# Altium project MainBoard_V100.PrjPcb (part 1 of 3)
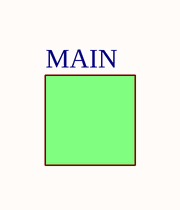
[diagram p0: MainBoard_V100_FRP.SchDoc]
GAuthor: Mihaly Szabo (PHY1HI); GBoardName: MainBoard; GContact: szabomihaly2000@gmail.com; GProjectName: RIID; GVersion: V100
22 sheets, 323 parts. Net scope: flat (ports and power ports of the same name join across sheets).
Board file: MainBoard_V100.PcbDoc
Sheets:
  MainBoard_V100_FRP.SchDoc
    MAIN = MainBoard_V100_MAIN.SchDoc
      PSU = MainBoard_V100_PSU.SchDoc
        PSU_DIG = MainBoard_V100_PSU_DIG.SchDoc
        U_MainBoard_V100_PSU_DET = MainBoard_V100_PSU_DET.SchDoc
        PSU_AFE = MainBoard_V100_PSU_AFE.SchDoc
        U_MainBoard_V100_CHARGER = MainBoard_V100_CHARGER.SchDoc
        PSU_5V = MainBoard_V100_PSU_5V.SchDoc
      CON = MainBoard_V100_CON.SchDoc
      AFE = MainBoard_V100_AFE.SchDoc
        U_MainBoard_V100_BLR = MainBoard_V100_BLR.SchDoc
        U_MainBoard_V100_CSP = MainBoard_V100_CSP.SchDoc
        U_MainBoard_V100_PEAKDET = MainBoard_V100_PEAKDET.SchDoc
      MEM = MainBoard_V100_MEM.SchDoc
      ON_OFF = MainBoard_V100_ON_OFF.SchDoc
      SD = MainBoard_V100_SD.SchDoc
      USB_MUX = MainBoard_V100_USB_MUX.SchDoc
      PER = MainBoard_V100_PER.SchDoc
      MCU = MainBoard_V100_MCU.SchDoc
      BLE = MainBoard_V100_BLE.SchDoc
      DISPLAY = MainBoard_V100_DISP.SchDoc
      TEMP = MainBoard_V100_TEMP.SchDoc

## Sheet MainBoard_V100_FRP.SchDoc
size A4; SheetNumber: 1; SheetTotal: 17

### Sub-sheets
MAIN = MainBoard_V100_MAIN.SchDoc: no entries

### Notes on the sheet
- Board:
- Author:
- Title:
- Project:
- SVN:
- Version:
- Sheet:
- of
- Contact:
- Modified:
- Size:
- A4

## Sheet MainBoard_V100_MAIN.SchDoc
size A4; SheetNumber: 2; SheetTotal: 22; Title_: Main Page
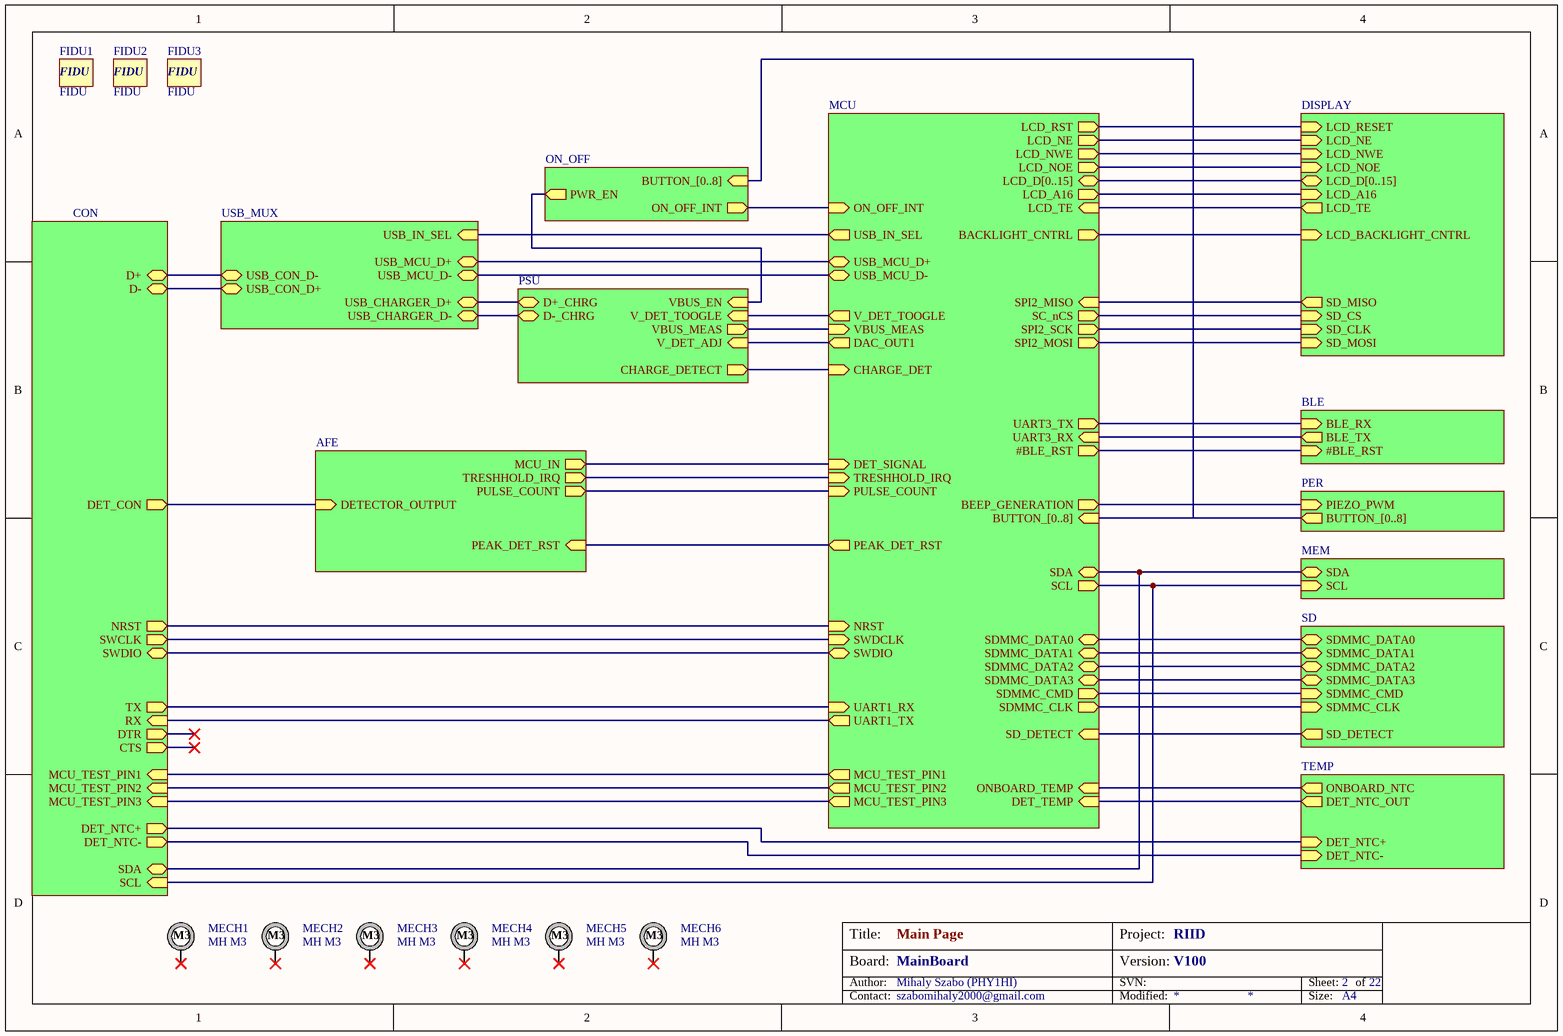
[diagram p1: MainBoard_V100_MAIN.SchDoc]

### Parts
FIDU1  FIDU  [FIDU_4x4]  (no BOM)
FIDU2  FIDU  [FIDU_4x4]  (no BOM)
FIDU3  FIDU  [FIDU_4x4]  (no BOM)
MECH1  MH M3  [PAD_M3 x 7]  (no BOM)
MECH2  MH M3  [PAD_M3 x 7]  (no BOM)
MECH3  MH M3  [PAD_M3 x 7]  (no BOM)
MECH4  MH M3  [PAD_M3 x 7]  (no BOM)
MECH5  MH M3  [PAD_M3 x 7]  (no BOM)
MECH6  MH M3  [PAD_M3 x 7]  (no BOM)

### Sub-sheets
AFE = MainBoard_V100_AFE.SchDoc: PEAK_DET_RST (in), TRESHHOLD_IRQ (out), PULSE_COUNT (out), DETECTOR_OUTPUT (in), MCU_IN (out)
BLE = MainBoard_V100_BLE.SchDoc: BLE_RX (in), BLE_TX (out), #BLE_RST (in)
CON = MainBoard_V100_CON.SchDoc: D+ (bidir), D- (bidir), CTS (out), TX (out), RX (in), DTR (out), NRST (out), SWCLK (out), SWDIO (bidir), DET_CON (out), DET_NTC+ (out), SDA (bidir), SCL (in), DET_NTC- (out), MCU_TEST_PIN1 (in), MCU_TEST_PIN2 (in), MCU_TEST_PIN3 (in)
DISPLAY = MainBoard_V100_DISP.SchDoc: LCD_RESET (in), LCD_NE (in), LCD_NWE (in), LCD_NOE (in), SD_MOSI (in), SD_CLK (in), SD_MISO (out), SD_CS (in), LCD_D[0..15] (bidir), LCD_A16 (in), LCD_TE (out), LCD_BACKLIGHT_CNTRL (in)
MCU = MainBoard_V100_MCU.SchDoc: #BLE_RST (out), BACKLIGHT_CNTRL (out), BEEP_GENERATION (out), DAC_OUT1 (out), DET_SIGNAL (in), LCD_A16 (out), LCD_D[0..15] (bidir), LCD_NE (out), LCD_NOE (out), LCD_NWE (out), LCD_RST (out), LCD_TE (in), NRST (in), ON_OFF_INT (in), PEAK_DET_RST (out), SCL (out), SDA (bidir), SDMMC_CLK (out), SDMMC_CMD (out), SD_DETECT (in), SPI2_MISO (in), SPI2_MOSI (out), SPI2_SCK (out), SWDCLK (in), SWDIO (bidir), TRESHHOLD_IRQ (in), UART1_RX (in), UART1_TX (out), UART3_RX (in), UART3_TX (out), USB_IN_SEL (out), USB_MCU_D+ (bidir), USB_MCU_D- (bidir), SDMMC_DATA3 (bidir), SDMMC_DATA2 (bidir), SDMMC_DATA0 (bidir), SDMMC_DATA1 (bidir), BUTTON_[0..8] (in), VBUS_MEAS (in), V_DET_TOOGLE (out), DET_TEMP (in), ONBOARD_TEMP (in), PULSE_COUNT (in), CHARGE_DET (in), SC_nCS (out), MCU_TEST_PIN1 (out), MCU_TEST_PIN2 (out), MCU_TEST_PIN3 (out)
MEM = MainBoard_V100_MEM.SchDoc: SDA (bidir), SCL (in)
ON_OFF = MainBoard_V100_ON_OFF.SchDoc: ON_OFF_INT (out), PWR_EN (out), BUTTON_[0..8] (in)
PER = MainBoard_V100_PER.SchDoc: PIEZO_PWM (in), BUTTON_[0..8] (out)
PSU = MainBoard_V100_PSU.SchDoc: VBUS_EN (in), VBUS_MEAS (out), D-_CHRG (bidir), D+_CHRG (bidir), V_DET_TOOGLE (in), V_DET_ADJ (in), CHARGE_DETECT (out)
SD = MainBoard_V100_SD.SchDoc: SDMMC_DATA1 (bidir), SDMMC_DATA0 (bidir), SDMMC_DATA3 (bidir), SDMMC_DATA2 (bidir), SD_DETECT (out), SDMMC_CLK (in), SDMMC_CMD (in)
TEMP = MainBoard_V100_TEMP.SchDoc: ONBOARD_NTC (out), DET_NTC- (in), DET_NTC+ (in), DET_NTC_OUT (out)
USB_MUX = MainBoard_V100_USB_MUX.SchDoc: USB_IN_SEL (in), USB_CON_D- (bidir), USB_CON_D+ (bidir), USB_MCU_D- (bidir), USB_MCU_D+ (bidir), USB_CHARGER_D- (bidir), USB_CHARGER_D+ (bidir)

### Nets
(unnamed): sheet PSU/VBUS_EN, sheet ON_OFF/PWR_EN
(unnamed): sheet PSU/VBUS_MEAS, sheet MCU/VBUS_MEAS
(unnamed): sheet PSU/D-_CHRG, sheet USB_MUX/USB_CHARGER_D-
(unnamed): sheet PSU/D+_CHRG, sheet USB_MUX/USB_CHARGER_D+
(unnamed): sheet PSU/V_DET_TOOGLE, sheet MCU/V_DET_TOOGLE
(unnamed): sheet PSU/V_DET_ADJ, sheet MCU/DAC_OUT1
(unnamed): sheet PSU/CHARGE_DETECT, sheet MCU/CHARGE_DET
(unnamed): sheet CON/D+, sheet USB_MUX/USB_CON_D-
(unnamed): sheet CON/D-, sheet USB_MUX/USB_CON_D+
(unnamed): sheet CON/TX, sheet MCU/UART1_RX
(unnamed): sheet CON/RX, sheet MCU/UART1_TX
(unnamed): sheet CON/NRST, sheet MCU/NRST
(unnamed): sheet CON/SWCLK, sheet MCU/SWDCLK
(unnamed): sheet CON/SWDIO, sheet MCU/SWDIO
(unnamed): sheet CON/DET_CON, sheet AFE/DETECTOR_OUTPUT
(unnamed): sheet CON/DET_NTC+, sheet TEMP/DET_NTC+
(unnamed): sheet CON/SDA, sheet MEM/SDA, sheet MCU/SDA
(unnamed): sheet CON/SCL, sheet MEM/SCL, sheet MCU/SCL
(unnamed): sheet CON/DET_NTC-, sheet TEMP/DET_NTC-
(unnamed): sheet CON/MCU_TEST_PIN1, sheet MCU/MCU_TEST_PIN1
(unnamed): sheet CON/MCU_TEST_PIN2, sheet MCU/MCU_TEST_PIN2
(unnamed): sheet CON/MCU_TEST_PIN3, sheet MCU/MCU_TEST_PIN3
(unnamed): sheet AFE/PEAK_DET_RST, sheet MCU/PEAK_DET_RST
(unnamed): sheet AFE/TRESHHOLD_IRQ, sheet MCU/TRESHHOLD_IRQ
(unnamed): sheet AFE/PULSE_COUNT, sheet MCU/PULSE_COUNT
(unnamed): sheet AFE/MCU_IN, sheet MCU/DET_SIGNAL
(unnamed): sheet ON_OFF/ON_OFF_INT, sheet MCU/ON_OFF_INT
(unnamed): sheet SD/SDMMC_DATA1, sheet MCU/SDMMC_DATA1
(unnamed): sheet SD/SDMMC_DATA0, sheet MCU/SDMMC_DATA0
(unnamed): sheet SD/SDMMC_DATA3, sheet MCU/SDMMC_DATA3
(unnamed): sheet SD/SDMMC_DATA2, sheet MCU/SDMMC_DATA2
(unnamed): sheet SD/SD_DETECT, sheet MCU/SD_DETECT
(unnamed): sheet SD/SDMMC_CLK, sheet MCU/SDMMC_CLK
(unnamed): sheet SD/SDMMC_CMD, sheet MCU/SDMMC_CMD
(unnamed): sheet USB_MUX/USB_IN_SEL, sheet MCU/USB_IN_SEL
(unnamed): sheet USB_MUX/USB_MCU_D-, sheet MCU/USB_MCU_D-
(unnamed): sheet USB_MUX/USB_MCU_D+, sheet MCU/USB_MCU_D+
(unnamed): sheet PER/PIEZO_PWM, sheet MCU/BEEP_GENERATION
(unnamed): sheet MCU/#BLE_RST, sheet BLE/#BLE_RST
(unnamed): sheet MCU/BACKLIGHT_CNTRL, sheet DISPLAY/LCD_BACKLIGHT_CNTRL
(unnamed): sheet MCU/LCD_A16, sheet DISPLAY/LCD_A16
(unnamed): sheet MCU/LCD_NE, sheet DISPLAY/LCD_NE
(unnamed): sheet MCU/LCD_NOE, sheet DISPLAY/LCD_NOE
(unnamed): sheet MCU/LCD_NWE, sheet DISPLAY/LCD_NWE
(unnamed): sheet MCU/LCD_RST, sheet DISPLAY/LCD_RESET
(unnamed): sheet MCU/LCD_TE, sheet DISPLAY/LCD_TE
(unnamed): sheet MCU/SPI2_MISO, sheet DISPLAY/SD_MISO
(unnamed): sheet MCU/SPI2_MOSI, sheet DISPLAY/SD_MOSI
(unnamed): sheet MCU/SPI2_SCK, sheet DISPLAY/SD_CLK
(unnamed): sheet MCU/UART3_RX, sheet BLE/BLE_TX
(unnamed): sheet MCU/UART3_TX, sheet BLE/BLE_RX
(unnamed): sheet MCU/DET_TEMP, sheet TEMP/DET_NTC_OUT
(unnamed): sheet MCU/ONBOARD_TEMP, sheet TEMP/ONBOARD_NTC
(unnamed): sheet MCU/SC_nCS, sheet DISPLAY/SD_CS

Not connected (* = marked no-connect by the designer): MECH1 M3*; MECH2 M3*; MECH3 M3*; MECH4 M3*; MECH5 M3*; MECH6 M3*

### Buses and harness runs
bus sheet DISPLAY/LCD_D[0..15] = sheet MCU/LCD_D[0..15]
bus sheet MCU/BUTTON_[0..8] = sheet ON_OFF/BUTTON_[0..8] = sheet PER/BUTTON_[0..8]

### Notes on the sheet
- Board:
- Author:
- Title:
- Project:
- SVN:
- Version:
- Sheet:
- of
- Contact:
- Modified:
- Size:
- A4

### Library data of the parts
FIDU1-FIDU3 = 275: FIDU, 4x4mm, rectangle; Azonosító: 275; Part Number: FIDU_4x4; Category: Electro-mechanicals; Subcategory: ELME_Other
MECH1-MECH6 = 268: 3.2/7mm Mounting_Hole_M3; Azonosító: 268; Part Number: Mounting_Hole_M3; Category: Electro-mechanicals; Subcategory: ELME_Other

## Sheet MainBoard_V100_PSU.SchDoc
size A4; SheetNumber: 3; SheetTotal: 22; Title_: PSU
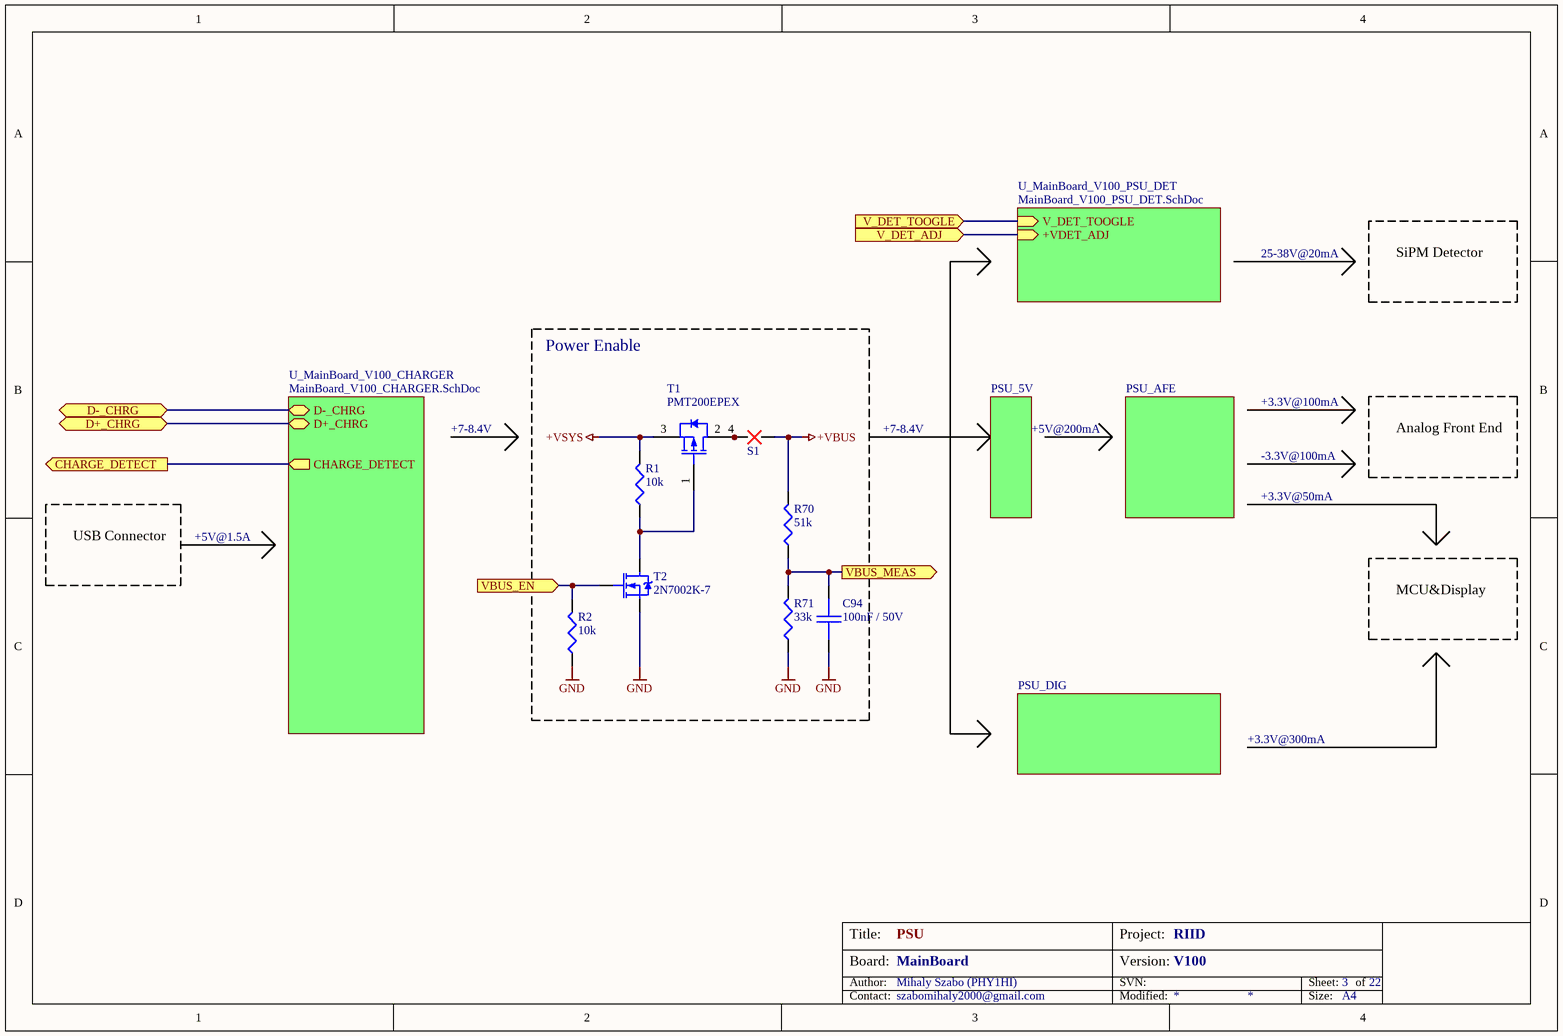
[diagram p2: MainBoard_V100_PSU.SchDoc]

### Parts
C94  100nF / 50V  [0805_C]
R1  10k  [0805]
R2  10k  [0805]
R70  51k  [0805]
R71  33k  [0805]
S1  SPLITER  [SPLITER2_30mil_9mil]  (value not drawn)  (no BOM)
T1  PMT200EPEX  [SOT-223]
T2  2N7002K-7  [SOT-23]

### Blocks framed on the sheet
Power Enable: C94 R1 R2 R70 R71 S1 T1 T2

### Sub-sheets
PSU_5V = MainBoard_V100_PSU_5V.SchDoc: no entries
PSU_AFE = MainBoard_V100_PSU_AFE.SchDoc: no entries
PSU_DIG = MainBoard_V100_PSU_DIG.SchDoc: no entries
U_MainBoard_V100_CHARGER = MainBoard_V100_CHARGER.SchDoc: D-_CHRG (bidir), D+_CHRG (bidir), CHARGE_DETECT (out)
U_MainBoard_V100_PSU_DET = MainBoard_V100_PSU_DET.SchDoc: V_DET_TOOGLE (in), +VDET_ADJ (in)

### Ports
CHARGE_DETECT (out), D+_CHRG (bidir), D-_CHRG (bidir), V_DET_ADJ (in), V_DET_TOOGLE (in), VBUS_EN (in), VBUS_MEAS (out)

### Nets
+VBUS: R70.2 S1.2
+VSYS: R1.2 T1.3(SOURCE)
GND: C94.2 R2.1 R71.1 T2.2(S)
V_DET_TOOGLE: port V_DET_TOOGLE, sheet U_MainBoard_V100_PSU_DET/V_DET_TOOGLE
VBUS_MEAS: C94.1 R70.1 R71.2 ; port VBUS_MEAS
NetR1_1: R1.1 T1.1(GATE) T2.3(D)
NetR2_2: R2.2 T2.1(G) ; port VBUS_EN
NetR72_1: port CHARGE_DETECT, sheet U_MainBoard_V100_CHARGER/CHARGE_DETECT
NetS1_1: S1.1 T1.2(DRAIN) T1.4(DRAIN)
NetU12_1: port D-_CHRG, sheet U_MainBoard_V100_CHARGER/D-_CHRG
NetU12_24: port D+_CHRG, sheet U_MainBoard_V100_CHARGER/D+_CHRG
(unnamed): port V_DET_ADJ, sheet U_MainBoard_V100_PSU_DET/+VDET_ADJ

### Notes on the sheet
- 25-38V@20mA
- SiPM Detector
- +7-8.4V
- +5V@200mA
- +3.3V@100mA
- Analog Front End
- -3.3V@100mA
- +3.3V@50mA
- USB Connector
- +5V@1.5A
- MCU&Display
- +3.3V@300mA
- Board:
- Author:
- Title:
- Project:
- SVN:
- Version:
- Sheet:
- of
- Contact:
- Modified:
- Size:
- A4

### Library data of the parts
C94 = 149: 100nF 50V X7R; Part Number: SMD0805-100nF-50V; Azonosító: 149; Category: Passives; Subcategory: PASS_Capacitor; Supplier 1: HESTORE; Supplier 1 order number: 100.011.22
R1 R2 = 59: 10k 0805 0.125W 1%; Part Number: SMD0805-10k 1%; Azonosító: 59; Category: Passives; Subcategory: PASS_Resistor; Supplier 1: HESTORE; Supplier 1 order number: 100.403.38
R70 = 64: 51k 0805 0.125W 5%; Part Number: SMD0805-51k 5%; Azonosító: 64; Category: Passives; Subcategory: PASS_Resistor; Supplier 1: HESTORE; Supplier 1 order number: 100.201.72
R71 = 62: 33k 0805 0.125W 5%; Part Number: SMD0805-33k 5%; Azonosító: 62; Category: Passives; Subcategory: PASS_Resistor; Supplier 1: HESTORE; Supplier 1 order number: 100.449.27
S1 = 272: SPLITER2_30mil_9mil; Azonosító: 272; Part Number: SPLITER2_30mil_9mil; Category: Accessories; Subcategory: ACCE_Other
T1 = 318: PMT200EPEX Power MOSFET, P Channel, 70 V, 2.4 A, 0.167 ohm, SOT-223, Surface Mount; Azonosító: 318; Part Number: PMT200EPEX; Category: Semiconductors; Subcategory: SEMI_FET; Supplier 1: MOUSER; Supplier 1 order number: 771-PMT200EPEX; Supplier 2: FARNELL; Supplier 2 order number: 3940765; Help URL: https://hu.mouser.com/datasheet/2/916/PMT200EPE-1319079.pdf
T2 = 315: 2N7002K-7 Power MOSFET, N Channel, 60 V, 300 mA, 2 ohm, SOT-23, Surface Mount; Azonosító: 315; Part Number: 2N7002K-7; Category: Semiconductors; Subcategory: SEMI_FET; Supplier 1: HESTORE; Supplier 1 order number: 100.411.92; Supplier 2: MOUSER; Supplier 2 order number: 621-2N7002K-7; Help URL: https://hu.mouser.com/datasheet/2/115/DIOD_S_A0012992590_1-2543827.pdf

## Sheet MainBoard_V100_PSU_DIG.SchDoc
size A4; SheetNumber: 7; SheetTotal: 22; Title_: Digital Power Supply
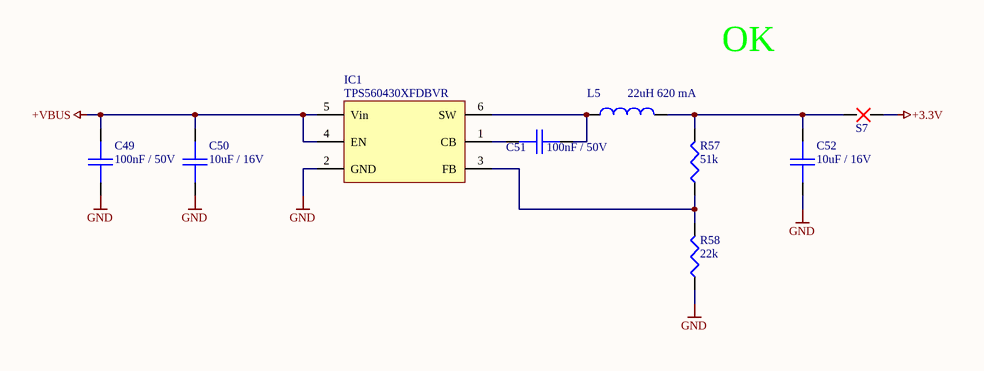
[diagram p3: MainBoard_V100_PSU_DIG.SchDoc]

### Parts
C49  100nF / 50V  [0805_C]
C50  10uF / 16V  [0805_C]
C51  100nF / 50V  [0805_C]
C52  10uF / 16V  [0805_C]
IC1  TPS560430XFDBVR  [SOT-23-6]
L5  22uH 620 mA  [1210]
R57  51k  [0805]
R58  22k  [0805]
S7  SPLITER  [SPLITER2_30mil_9mil]  (value not drawn)  (no BOM)

### Nets
+3.3V: S7.2
+VBUS: C49.1 C50.1 IC1.4(EN) IC1.5(Vin)
GND: C49.2 C50.2 C52.2 IC1.2(GND) R58.1
NetC51_1: C51.1 IC1.1(CB)
NetC51_2: C51.2 IC1.6(SW) L5.1
NetC52_1: C52.1 L5.2 R57.2 S7.1
NetIC1_3: IC1.3(FB) R57.1 R58.2

### Notes on the sheet
- OK
- Board:
- Author:
- Title:
- Project:
- SVN:
- Version:
- Sheet:
- of
- Contact:
- Modified:
- Size:
- A4

### Library data of the parts
C49 C51 = 149: as C94 on sheet MainBoard_V100_PSU; Category: Passives; Subcategory: PASS_Capacitor; Supplier 1: HESTORE; Supplier 1 order number: 100.011.22
C50 C52 = 153: 10uF 16V X5R; Part Number: SMD0805-10uF-16V; Azonosító: 153; Category: Passives; Subcategory: PASS_Capacitor; Supplier 1: HESTORE; Supplier 1 order number: 100.344.52
IC1 = 192: SIMPLE SWITCHER 4-V to 36-V, 600-mA Synchronous Step-Down Converter; Azonosító: 192; Part Number: TPS560430XFDBVR; Category: Integrated Circuits; Subcategory: ICs__Power; Supplier 1: MOUSER; Supplier 1 order number: 595-TPS560430XFDBVR; Supplier 2: DIGIKEY; Supplier 2 order number: 296-52607-1-ND; Help URL: https://www.ti.com/general/docs/suppproductinfo.tsp?distId=26&gotoUrl=https://www.ti.com/lit/gpn/tps560430
L5 = 387: 22uH 620 mA 1210; Part Number: CBC3225T220KR; Azonosító: 387; Category: Passives; Subcategory: PASS_Inductor; Supplier 1: MOUSER; Supplier 1 order number: 963-CBC3225T220KR; Help URL: https://hu.mouser.com/datasheet/2/396/wound02_e-2256580.pdf
R57 = 64: as R70 on sheet MainBoard_V100_PSU; Category: Passives; Subcategory: PASS_Resistor; Supplier 1: HESTORE; Supplier 1 order number: 100.201.72
R58 = 388: 22k 0805 0.1W 5%; Part Number: SMD0805-22k-5%; Azonosító: 388; Category: Passives; Subcategory: PASS_Resistor; Supplier 1: HESTORE; Supplier 1 order number: 100.011.64
S7 = 272: SPLITER2_30mil_9mil; Azonosító: 272; Part Number: SPLITER2_30mil_9mil; Category: Accessories; Subcategory: ACCE_Other

## Sheet MainBoard_V100_PSU_DET.SchDoc
size A4; SheetNumber: 5; SheetTotal: 22; Title_: Detector Power Supply
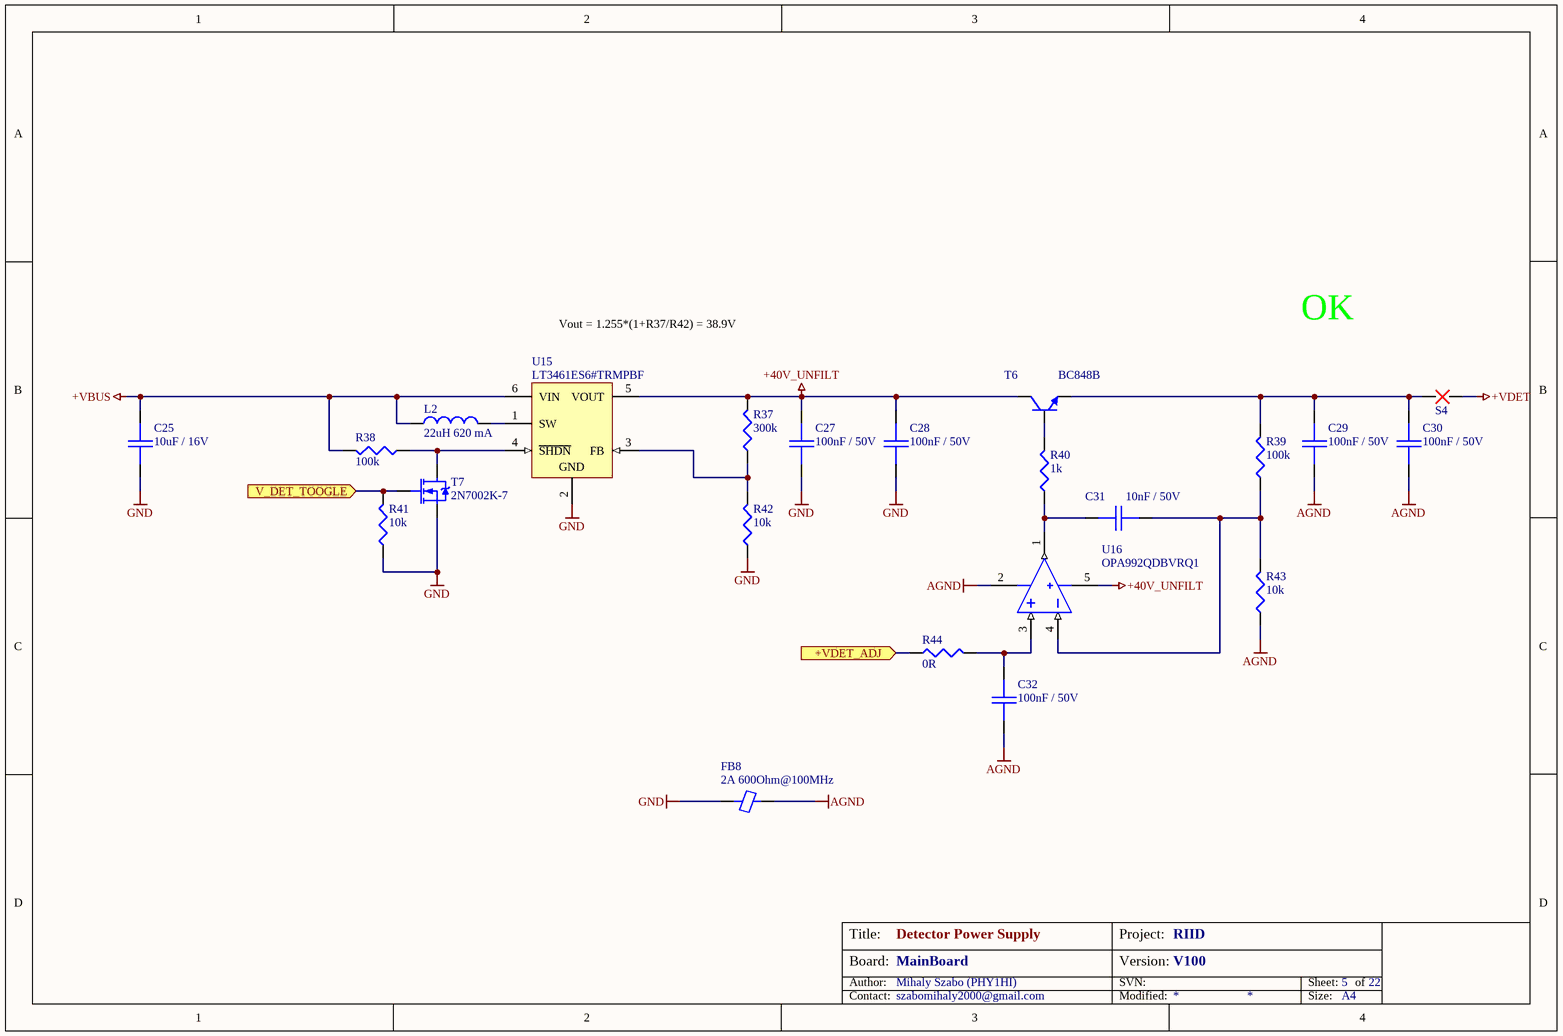
[diagram p4: MainBoard_V100_PSU_DET.SchDoc]

### Parts
C25  10uF / 16V  [0805_C]
C27  100nF / 50V  [0805_C]
C28  100nF / 50V  [0805_C]
C29  100nF / 50V  [0805_C]
C30  100nF / 50V  [0805_C]
C31  10nF / 50V  [0805_C]
C32  100nF / 50V  [0805_C]
FB8  2A 600Ohm@100MHz  [0805_FB]
L2  22uH 620 mA  [1210]
R37  300k  [0805]
R38  100k  [0805]
R39  100k  [0805]
R40  1k  [0805]
R41  10k  [0805]
R42  10k  [0805]
R43  10k  [0805]
R44  0R  [0805]
S4  SPLITER  [SPLITER2_30mil_9mil]  (value not drawn)  (no BOM)
T6  BC848B  [SOT-23]
T7  2N7002K-7  [SOT-23]
U15  LT3461ES6#TRMPBF  [SOT-23-6L]
U16  OPA992QDBVRQ1  [SOT-23-5]

### Ports
+VDET_ADJ (in), V_DET_TOOGLE (in)

### Nets
+40V_UNFILT: C27.1 C28.1 R37.2 T6.3(C) U15.5(VOUT) U16.5(V+)
+VBUS: C25.1 L2.1 R38.2 U15.6(VIN)
+VDET: S4.2
AGND: C29.2 C30.2 C32.1 FB8.2 R43.1 U16.2(V-)
GND: C25.2 C27.2 C28.2 FB8.1 R41.1 R42.1 T7.2(S) U15.2(GND)
V_DET_TOOGLE: R41.2 T7.1(G) ; port V_DET_TOOGLE
NetC29_1: C29.1 C30.1 R39.2 S4.1 T6.2(E)
NetC31_1: C31.1 R40.1 U16.1(OUT)
NetC31_2: C31.2 R39.1 R43.2 U16.4(IN-)
NetC32_2: C32.2 R44.2 U16.3(IN+)
NetL2_2: L2.2 U15.1(SW)
NetR37_1: R37.1 R42.2 U15.3(FB)
NetR38_1: R38.1 T7.3(D) U15.4(~{SHDN})
NetR40_2: R40.2 T6.1(B)
NetR44_1: R44.1 ; port +VDET_ADJ

### Notes on the sheet
- Vout = 1.255*(1+R37/R42) = 38.9V
- OK
- Board:
- Author:
- Title:
- Project:
- SVN:
- Version:
- Sheet:
- of
- Contact:
- Modified:
- Size:
- A4

### Library data of the parts
C25 = 153: as C50 on sheet MainBoard_V100_PSU_DIG; Category: Passives; Subcategory: PASS_Capacitor; Supplier 1: HESTORE; Supplier 1 order number: 100.344.52
C27-C30 C32 = 149: as C94 on sheet MainBoard_V100_PSU; Category: Passives; Subcategory: PASS_Capacitor; Supplier 1: HESTORE; Supplier 1 order number: 100.011.22
C31 = 146: 10nF 50V X7R; Part Number: SMD0805-10nF-50V; Azonosító: 146; Category: Passives; Subcategory: PASS_Capacitor; Supplier 1: HESTORE; Supplier 1 order number: 100.011.24
FB8 = 183: Ferrite bead 2A 600Ohm@100MHz; Part Number: LCBB-601 SMD; Azonosító: 183; Category: Passives; Subcategory: PASS_Other; Supplier 1: HESTORE; Supplier 1 order number: 100.327.86
L2 = 387: as L5 on sheet MainBoard_V100_PSU_DIG; Category: Passives; Subcategory: PASS_Inductor; Supplier 1: MOUSER; Supplier 1 order number: 963-CBC3225T220KR; Help URL: https://hu.mouser.com/datasheet/2/396/wound02_e-2256580.pdf
R37 = 68: 300k 0805 0.125W 1%; Part Number: SMD0805-300k 1%; Azonosító: 68; Category: Passives; Subcategory: PASS_Resistor; Supplier 1: HESTORE; Supplier 1 order number: 100.437.89
R38 R39 = 66: 100k 0805 0.125W 5%; Part Number: SMD0805-100k 5%; Azonosító: 66; Category: Passives; Subcategory: PASS_Resistor; Supplier 1: HESTORE; Supplier 1 order number: 100.011.43
R40 = 52: 1k 0805 0.125W 1%; Part Number: SMD0805-1k 1%; Azonosító: 52; Category: Passives; Subcategory: PASS_Resistor; Supplier 1: HESTORE; Supplier 1 order number: 100.312.99
R41-R43 = 59: as R1 on sheet MainBoard_V100_PSU; Category: Passives; Subcategory: PASS_Resistor; Supplier 1: HESTORE; Supplier 1 order number: 100.403.38
R44 = 38: 0R 0805 0.125W 5%; Part Number: 0 R 5%; Azonosító: 38; Category: Passives; Subcategory: PASS_Resistor; Supplier 1: HESTORE; Supplier 1 order number: 100.275.70
S4 = 272: SPLITER2_30mil_9mil; Azonosító: 272; Part Number: SPLITER2_30mil_9mil; Category: Accessories; Subcategory: ACCE_Other
T6 = 309: Bipolar (BJT) Single Transistor, NPN, 30 V, 100 mA, 300 mW, SOT-23, Surface Mount; Azonosító: 309; Part Number: BC848B; Category: Semiconductors; Subcategory: SEMI_Transistor; Supplier 1: HESTORE; Supplier 1 order number: 100.209.08; Supplier 2: MOUSER; Supplier 2 order number: 637-BC848B; Help URL: https://hu.mouser.com/datasheet/2/849/bc846-3324195.pdf
T7 = 315: as T2 on sheet MainBoard_V100_PSU; Part Number: 2N7002K-7; Category: Semiconductors; Subcategory: SEMI_FET; Supplier 1: HESTORE; Supplier 1 order number: 100.411.92; Supplier 2: MOUSER; Supplier 2 order number: 621-2N7002K-7; Help URL: https://hu.mouser.com/datasheet/2/115/DIOD_S_A0012992590_1-2543827.pdf
U15 = 328: 1.3 MHz Step-Up DC/DC Converter with Integrated Schottky, 6-pin SOT23 (S6-6), -40 to 85°C; Azonosító: 328; ComponentLink1Description: Datasheet; ComponentLink1URL: http://cds.linear.com/docs/en/datasheet/3461af.pdf; Part Number: LT3461ES6#TRMPBF; Category: Integrated Circuits; Subcategory: IC_Power; Supplier 1: MOUSER; Supplier 1 order number: 584-LT3461ES6#TRMPBF; Help URL: https://hu.mouser.com/datasheet/2/609/3461Afa-3123928.pdf
U16 = 358: OPA992-Q1 Automotive, 40-V Rail-to-Rail Input or Output,Low Offset Voltage, Low Noise Op Amp GBW 10.6MHz; Manufacturer_Name: Texas Instruments; Manufacturer_Part_Number: INA180A2IDBVR; Geometry.Height: 1.45mm; Azonosító: 358; Mouser Part Number: 595-INA180A2IDBVR; Mouser Price/Stock: https://www.mouser.co.uk/ProductDetail/Texas-Instruments/INA180A2IDBVR?qs=5aG0NVq1C4wYcJfa99BoHg%3D%3D; Datasheet Link: http://www.ti.com/lit/ds/symlink/ina180.pdf; Part Number: OPA992QDBVRQ1; Category: Integrated Circuits; Subcategory: IC_Analog; Supplier 1: MOUSER; Supplier 1 order number: 595-OPA992QDBVRQ1; Help URL: https://www.ti.com/general/docs/suppproductinfo.tsp?distId=26&gotoUrl=https://www.ti.com/lit/gpn/opa992-q1

## Sheet MainBoard_V100_PSU_AFE.SchDoc
size A4; SheetNumber: 6; SheetTotal: 22; Title_: Analog Power Supply
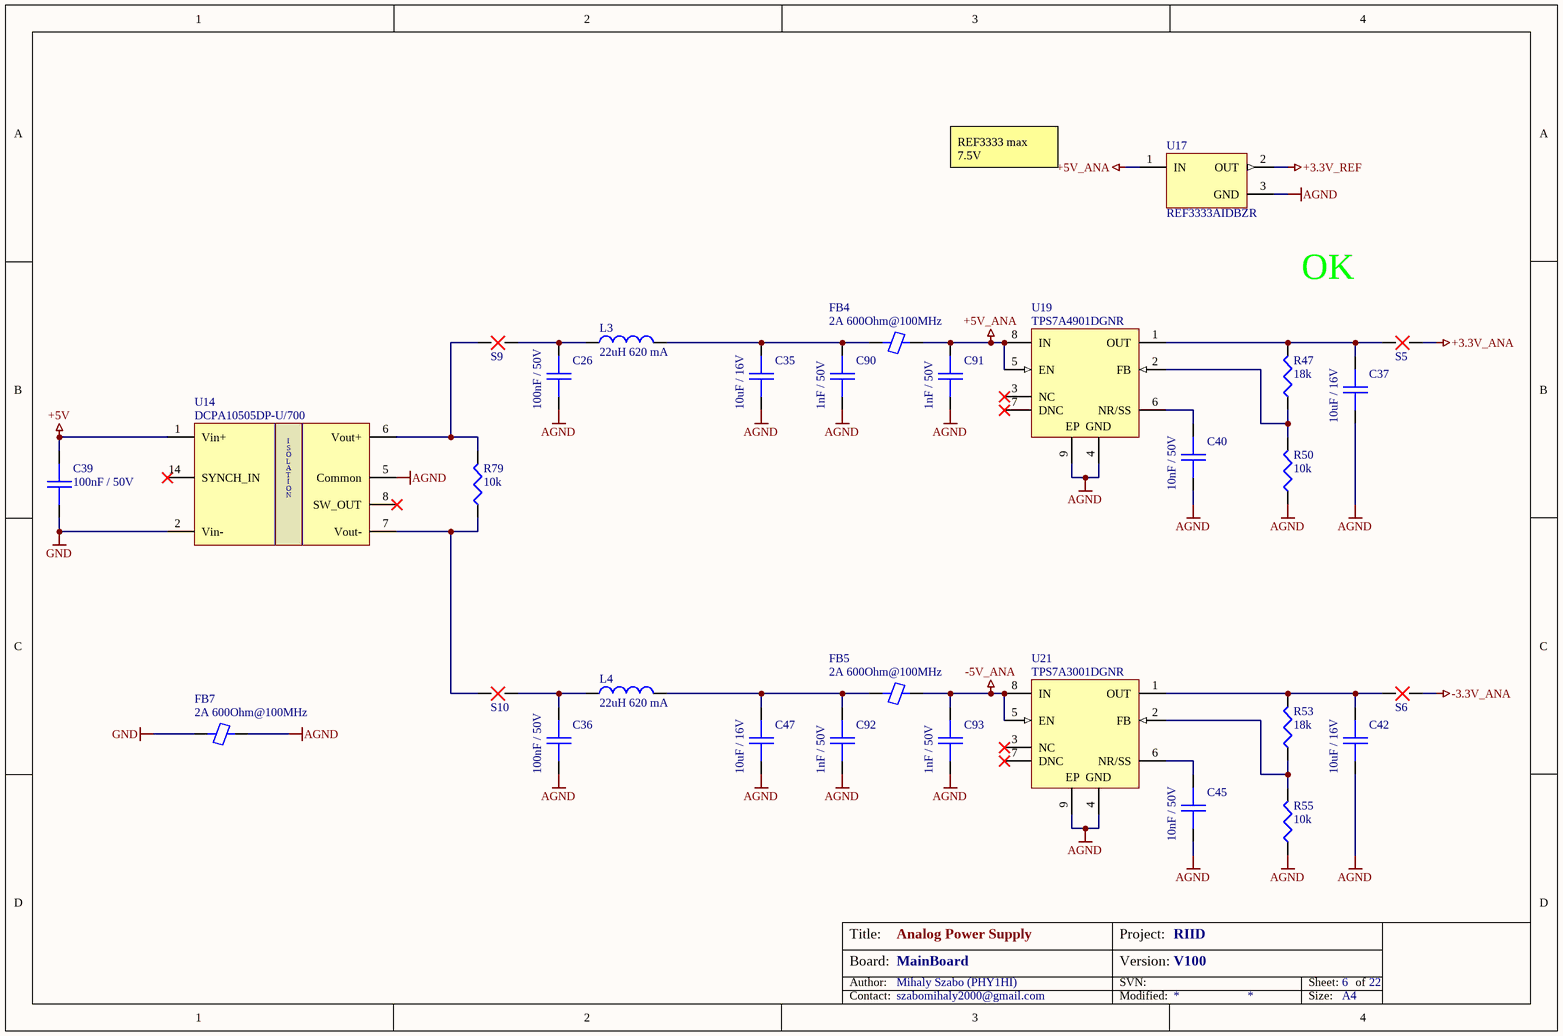
[diagram p5: MainBoard_V100_PSU_AFE.SchDoc]

### Parts
C26  100nF / 50V  [0805_C]
C35  10uF / 16V  [0805_C]
C36  100nF / 50V  [0805_C]
C37  10uF / 16V  [0805_C]
C39  100nF / 50V  [0805_C]
C40  10nF / 50V  [0805_C]
C42  10uF / 16V  [0805_C]
C45  10nF / 50V  [0805_C]
C47  10uF / 16V  [0805_C]
C90  1nF / 50V  [0805_C]
C91  1nF / 50V  [0805_C]
C92  1nF / 50V  [0805_C]
C93  1nF / 50V  [0805_C]
FB4  2A 600Ohm@100MHz  [0805_FB]
FB5  2A 600Ohm@100MHz  [0805_FB]
FB7  2A 600Ohm@100MHz  [0805_FB]
L3  22uH 620 mA  [1210]
L4  22uH 620 mA  [1210]
R47  18k  [0805]
R50  10k  [0805]
R53  18k  [0805]
R55  10k  [0805]
R79  10k  [0805]
S5  SPLITER  [SPLITER2_30mil_9mil]  (value not drawn)  (no BOM)
S6  SPLITER  [SPLITER2_30mil_9mil]  (value not drawn)  (no BOM)
S9  SPLITER  [SPLITER2_30mil_9mil]  (value not drawn)  (no BOM)
S10  SPLITER  [SPLITER2_30mil_9mil]  (value not drawn)  (no BOM)
U14  DCPA10505DP-U/700  [SOP-7]
U17  REF3333AIDBZR  [SOT-23]
U19  TPS7A4901DGNR  [MSOP-8 TP]
U21  TPS7A3001DGNR  [MSOP-8 TP]

### Nets
+3.3V_ANA: S5.2
+3.3V_REF: U17.2(OUT)
+5V: C39.1 U14.1(Vin+)
+5V_ANA: C91.1 FB4.2 U17.1(IN) U19.5(EN) U19.8(IN)
-3.3V_ANA: S6.2
-5V_ANA: C93.1 FB5.2 U21.5(EN) U21.8(IN)
AGND: C26.2 C35.2 C36.2 C37.1 C40.2 C42.1 C45.2 C47.2 C90.2 C91.2 C92.2 C93.2 FB7.2 R50.1 R55.1 U14.5(Common) U17.3(GND) U19.4(GND) U19.9(EP) U21.4(GND) U21.9(EP)
GND: C39.2 FB7.1 U14.2(Vin-)
NetC26_1: C26.1 L3.1 S9.2
NetC35_1: C35.1 C90.1 FB4.1 L3.2
NetC36_1: C36.1 L4.1 S10.2
NetC37_2: C37.2 R47.2 S5.1 U19.1(OUT)
NetC40_1: C40.1 U19.6(NR/SS)
NetC42_2: C42.2 R53.2 S6.1 U21.1(OUT)
NetC45_1: C45.1 U21.6(NR/SS)
NetC47_1: C47.1 C92.1 FB5.1 L4.2
NetR47_1: R47.1 R50.2 U19.2(FB)
NetR53_1: R53.1 R55.2 U21.2(FB)
NetR79_1: R79.1 S10.1 U14.7(Vout-)
NetR79_2: R79.2 S9.1 U14.6(Vout+)

Not connected (* = marked no-connect by the designer): U14 8(SW_OUT)* 14(SYNCH_IN)*; U19 3(NC)* 7(DNC)*; U21 3(NC)* 7(DNC)*

### Notes on the sheet
- REF3333 max 7.5V
- OK
- Board:
- Author:
- Title:
- Project:
- SVN:
- Version:
- Sheet:
- of
- Contact:
- Modified:
- Size:
- A4
- (in symbol 402) I; S; O; L; A; T; N

### Library data of the parts
C26 C36 C39 = 149: as C94 on sheet MainBoard_V100_PSU; Category: Passives; Subcategory: PASS_Capacitor; Supplier 1: HESTORE; Supplier 1 order number: 100.011.22
C35 C37 C42 C47 = 153: as C50 on sheet MainBoard_V100_PSU_DIG; Category: Passives; Subcategory: PASS_Capacitor; Supplier 1: HESTORE; Supplier 1 order number: 100.344.52
C40 C45 = 146: as C31 on sheet MainBoard_V100_PSU_DET; Category: Passives; Subcategory: PASS_Capacitor; Supplier 1: HESTORE; Supplier 1 order number: 100.011.24
C90-C93 = 144: 1nF 50V X7R; Part Number: SMD0805-1nF-50V; Azonosító: 144; Category: Passives; Subcategory: PASS_Capacitor; Supplier 1: HESTORE; Supplier 1 order number: 100.200.70
FB4 FB5 FB7 = 183: as FB8 on sheet MainBoard_V100_PSU_DET; Category: Passives; Subcategory: PASS_Other; Supplier 1: HESTORE; Supplier 1 order number: 100.327.86
L3 L4 = 387: as L5 on sheet MainBoard_V100_PSU_DIG; Category: Passives; Subcategory: PASS_Inductor; Supplier 1: MOUSER; Supplier 1 order number: 963-CBC3225T220KR; Help URL: https://hu.mouser.com/datasheet/2/396/wound02_e-2256580.pdf
R47 R53 = 406: 18k 0805 0.125W 1%; Part Number: SMD0805-18K-1%; Azonosító: 406; Category: Passives; Subcategory: PASS_Resistor; Supplier 1: HESTORE; Supplier 1 order number: 100.437.83
R50 R55 R79 = 59: as R1 on sheet MainBoard_V100_PSU; Category: Passives; Subcategory: PASS_Resistor; Supplier 1: HESTORE; Supplier 1 order number: 100.403.38
S5 S6 S9 S10 = 272: SPLITER2_30mil_9mil; Azonosító: 272; Part Number: SPLITER2_30mil_9mil; Category: Accessories; Subcategory: ACCE_Other
U14 = 402: Isolated DC/DC Converter, Vin = 5V, Vout = +/-5V, 1W, Isolated Unregulated,  7-SOP; Azonosító: 402; Part Number: DCPA10505DP-U/700; Category: Integrated Circuits; Subcategory: IC_Power; Supplier 1: MOUSER; Supplier 1 order number: 595-DCPA10505DPU/700; Help URL: https://www.ti.com/lit/ds/symlink/dcpa10505d.pdf?ts=1710773135857&ref_url=https%253A%252F%252Fhu.mouser.com%252F
U17 = 363: VOLTAGE REF, SERIES, 3.3V, SOT-23-3 ,0.15 %,30ppm/°C; Azonosító: 363; Part Number: REF3333AIDBZR; Category: Semiconductors; Subcategory: IC_Power; Supplier 1: MOUSER; Supplier 1 order number: 595-REF3333AIDBZR; Supplier 2: FARNELL; Supplier 2 order number: 3124553; Help URL: https://www.ti.com/lit/ds/symlink/ref3333.pdf?ts=1704361235069&ref_url=https%253A%252F%252Fhu.mouser.com%252F
U19 = 385: LDO Voltage Regulator, Adjustable, 3 V to 35 V in, 333 mV drop, 1.194 V to 33 V/150 mA out, MSOP-8; Azonosító: 385; Part Number: TPS7A4901DGNR; Category: Integrated Circuits; Subcategory: IC_Power; Supplier 1: MOUSER; Supplier 1 order number: 595-TPS7A4901DGNR; Help URL: https://www.ti.com/lit/ds/symlink/tps7a49.pdf?ts=1708810798586
U21 = 386: LDO Voltage Regulators -3V to -36V,-200mA High PSRR, LDO Reg; Azonosító: 386; Part Number: TPS7A3001DGNR; Category: Integrated Circuits; Subcategory: IC_Power; Supplier 1: MOUSER; Supplier 1 order number: 595-TPS7A3001DGNR; Help URL: https://www.ti.com/lit/ds/symlink/tps7a30.pdf?ts=1708885018535&ref_url=https%253A%252F%252Fhu.mouser.com%252F

## Sheet MainBoard_V100_CHARGER.SchDoc
size A4; SheetNumber: 4; SheetTotal: 22; Title_: Battery Charger & Balancer
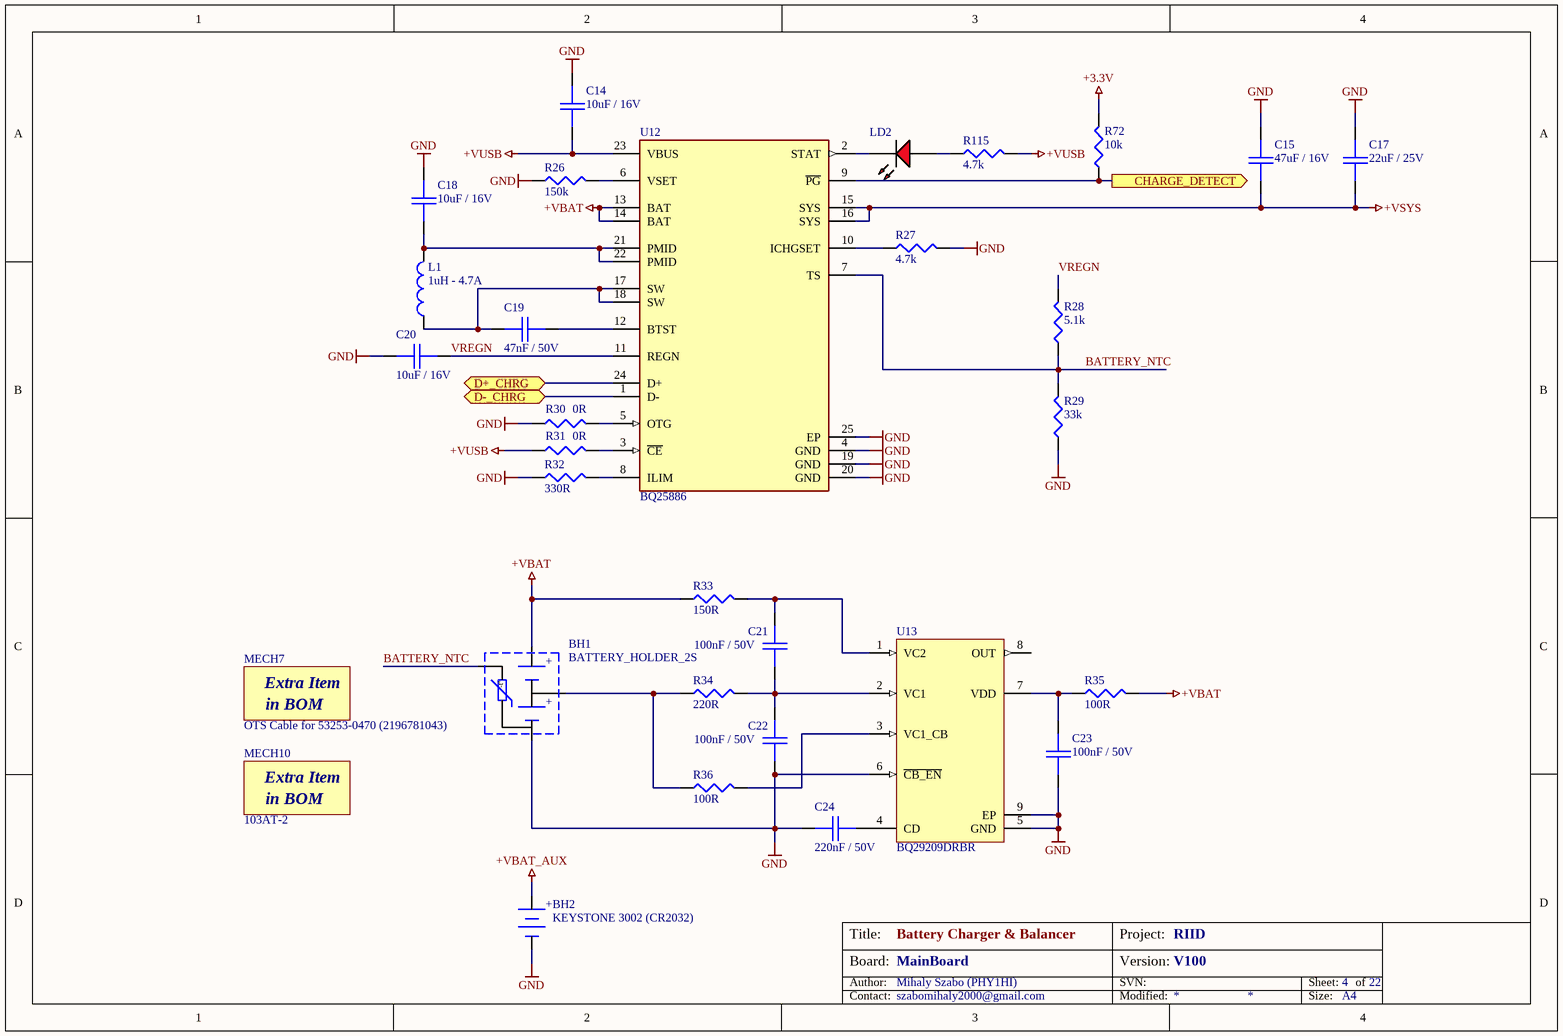
[diagram p6: MainBoard_V100_CHARGER.SchDoc]

### Parts
BH1  BATTERY_HOLDER_2S  [MOLEX-53253-0470]
BH2  KEYSTONE 3002 (CR2032)  [BATTERY_HOLDER_KEYSTONE_3002]
C14  10uF / 16V  [0805_C]
C15  47uF / 16V  [1210_C]
C17  22uF / 25V  [1210_C]
C18  10uF / 16V  [0805_C]
C19  47nF / 50V  [0805_C]
C20  10uF / 16V  [0805_C]
C21  100nF / 50V  [0805_C]
C22  100nF / 50V  [0805_C]
C23  100nF / 50V  [0805_C]
C24  220nF / 50V  [0805_C]
L1  1uH - 4.7A  [2520_IND]
LD2  HSMS-C110 (RED)  [LED_SMD_90DEG_RED]  (value not drawn)
MECH7  OTS Cable for 53253-0470 (2196781043)  (mechanical)
MECH10  103AT-2  (mechanical)
R26  150k  [0805]
R27  4.7k  [0805]
R28  5.1k  [0805]
R29  33k  [0805]
R30  0R  [0805]
R31  0R  [0805]
R32  330R  [0805]
R33  150R  [0805]
R34  220R  [0805]
R35  100R  [0805]
R36  100R  [0805]
R72  10k  [0805]
R115  4.7k  [0805]
U12  BQ25886  [VQFN-24]
U13  BQ29209DRBR  [VSON-8]

### Ports
CHARGE_DETECT (out), D+_CHRG (bidir), D-_CHRG (bidir)

### Nets
+3.3V: R72.2
+VBAT: BH1.1 R33.1 R35.1 U12.13(BAT) U12.14(BAT)
+VBAT_AUX: BH2.1
+VSYS: C15.2 C17.2 U12.15(SYS) U12.16(SYS)
+VUSB: C14.2 R31.1 R115.2 U12.23(VBUS)
GND: BH1.3 BH2.2 C14.1 C15.1 C17.1 C18.1 C20.1 C22.2 C23.1 C24.1 R26.1 R27.2 R29.1 R30.1 R32.1 U12.4(GND) U12.19(GND) U12.20(GND) U12.25(EP) U13.5(GND) U13.6(~{CB_EN}) U13.9(EP)
BATTERY_NTC: BH1.4 R28.1 R29.2 U12.7(TS)
VREGN: C20.2 R28.2 U12.11(REGN)
NetBH1_2: BH1.2 R34.1 R36.1
NetC18_2: C18.2 L1.2 U12.21(PMID) U12.22(PMID)
NetC19_1: C19.1 L1.1 U12.17(SW) U12.18(SW)
NetC19_2: C19.2 U12.12(BTST)
NetC21_1: C21.1 R33.2 U13.1(VC2)
NetC21_2: C21.2 C22.1 R34.2 U13.2(VC1)
NetC23_2: C23.2 R35.2 U13.7(VDD)
NetC24_2: C24.2 U13.4(CD)
NetLD2_A: LD2.A R115.1
NetLD2_K: LD2.K U12.2(STAT)
NetR26_2: R26.2 U12.6(VSET)
NetR27_1: R27.1 U12.10(ICHGSET)
NetR30_2: R30.2 U12.5(OTG)
NetR31_2: R31.2 U12.3(~{CE})
NetR32_2: R32.2 U12.8(ILIM)
NetR36_2: R36.2 U13.3(VC1_CB)
NetR72_1: R72.1 U12.9(~{PG}) ; port CHARGE_DETECT
NetU12_1: U12.1(D-) ; port D-_CHRG
NetU12_24: U12.24(D+) ; port D+_CHRG

Not connected (* = marked no-connect by the designer): U13 8(OUT)

### Notes on the sheet
- Board:
- Author:
- Title:
- Project:
- SVN:
- Version:
- Sheet:
- of
- Contact:
- Modified:
- Size:
- A4
- (in symbol 252) +
- (in symbol 380) +; -t°
- (in symbol 409) Extra Item; in BOM
- (in symbol 410) Extra Item; in BOM

### Library data of the parts
BH1 = 380: 2S Battery with NTC thermistor; Azonosító: 380; Part Number: BATTERY_HOLDER_2S; Category: Accessories; Subcategory: ACCE_Battery
BH2 = 252: Battery Holder, CR2032; Part Number: BATTERY_HOLDER_CR2032; Azonosító: 252; Category: Connectors; Subcategory: CONN_Other; Supplier 1: MOUSER; Supplier 1 order number: 534-3002; Supplier 2: FARNELL; Supplier 2 order number: 1650693; Help URL: https://hu.mouser.com/datasheet/2/215/3002TR-745631.pdf
C14 C18 C20 = 153: as C50 on sheet MainBoard_V100_PSU_DIG; Category: Passives; Subcategory: PASS_Capacitor; Supplier 1: HESTORE; Supplier 1 order number: 100.344.52
C15 = 171: 47uF 16V X5R; Part Number: SMD1210-47uF-16V; Azonosító: 171; Category: Passives; Subcategory: PASS_Capacitor; Supplier 1: HESTORE; Supplier 1 order number: 100.353.29
C17 = 170: 22uF 25V X5R; Part Number: SMD1210-22uF-25V; Azonosító: 170; Category: Passives; Subcategory: PASS_Capacitor; Supplier 1: HESTORE; Supplier 1 order number: 100.353.27
C19 = 375: 47nF 50V X7R; Part Number: SMD0805-47nF-50V; Azonosító: 375; Category: Passives; Subcategory: PASS_Capacitor; Supplier 1: HESTORE; Supplier 1 order number: 100.011.36
C21-C23 = 149: as C94 on sheet MainBoard_V100_PSU; Category: Passives; Subcategory: PASS_Capacitor; Supplier 1: HESTORE; Supplier 1 order number: 100.011.22
C24 = 150: 220nF 50V Y5V; Part Number: SMD0805-220nF-50V; Azonosító: 150; Category: Passives; Subcategory: PASS_Capacitor; Supplier 1: HESTORE; Supplier 1 order number: 100.200.75
L1 = 376: 1uH  / 20% 4.7A; Part Number: SMD-2520-1uH-20%; Azonosító: 376; Category: Passives; Subcategory: PASS_Inductor; Supplier 1: MOUSER; Supplier 1 order number: 81-DFE252012F-1R0MP2; Help URL: https://hu.mouser.com/datasheet/2/281/1/J_E_TE243A_0017-3158849.pdf
LD2 = 290: LED, Red, SMD, 20 mA, 2.1 V, 626 nm; Azonosító: 290; Part Number: HSMS-C110; Category: Optoelectronics; Subcategory: OPTO_LED; Supplier 1: MOUSER; Supplier 1 order number: 630-HSMS-C110; Supplier 2: FARNELL; Supplier 2 order number: 3229567; Help URL: https://hu.mouser.com/datasheet/2/678/AV02_0551EN_DS_HSMx_Cxxx_25Mar2022-1827675.pdf
MECH7 = 409: Rectangular Cable Assemblies Micro-Latch-to-Micro-Latch (OTS) Cbl Asmbly 2mm Pitch Tin Plating 300mm Length 4; Azonosító: 409; Part Number: 2196781043; Category: Accessories; Subcategory: ACCE_Other; Supplier 1: MOUSER; Supplier 1 order number: 538-219678-1043; Help URL: https://www.molex.com/en-us/products/part-detail/2196781043
MECH10 = 410: NTC (Negative Temperature Coefficient) Thermistors 10kohm 1%; Azonosító: 410; Part Number: 103AT-2; Category: Accessories; Subcategory: ACCE_Other; Supplier 1: MOUSER; Supplier 1 order number: 954-103AT-2; Help URL: https://hu.mouser.com/datasheet/2/362/semitec_atthermistor-1202913.pdf
R26 = 377: 150k 0805 0.125W 1%; Part Number: SMD-0805-150k-1%; Azonosító: 377; Category: Passives; Subcategory: PASS_Resistor; Supplier 1: HESTORE; Supplier 1 order number: 100.397.63
R27 R115 = 56: 4.7k 0805 0.125W 5%; Part Number: SMD0805-4.7k 5%; Azonosító: 56; Category: Passives; Subcategory: PASS_Resistor; Supplier 1: HESTORE; Supplier 1 order number: 100.011.83
R28 = 378: 5.1k 0805 0.125W 5%; Part Number: SMD0805-5.1k 5%; Azonosító: 378; Category: Passives; Subcategory: PASS_Resistor; Supplier 1: HESTORE; Supplier 1 order number: 100.013.49
R29 = 62: as R71 on sheet MainBoard_V100_PSU; Category: Passives; Subcategory: PASS_Resistor; Supplier 1: HESTORE; Supplier 1 order number: 100.449.27
R30 R31 = 38: as R44 on sheet MainBoard_V100_PSU_DET; Category: Passives; Subcategory: PASS_Resistor; Supplier 1: HESTORE; Supplier 1 order number: 100.275.70
R32 = 48: 330R 0805 0.125W 5%; Part Number: SMD0805-330R 5%; Azonosító: 48; Category: Passives; Subcategory: PASS_Resistor; Supplier 1: HESTORE; Supplier 1 order number: 100.011.70
R33 = 46: 150R 0805 0.125W 5%; Part Number: SMD0805-150R 5%; Azonosító: 46; Category: Passives; Subcategory: PASS_Resistor; Supplier 1: HESTORE; Supplier 1 order number: 100.011.49
R34 = 47: 220R 0805 0.125W 5%; Part Number: SMD0805-220R 5%; Azonosító: 47; Category: Passives; Subcategory: PASS_Resistor; Supplier 1: HESTORE; Supplier 1 order number: 100.011.62
R35 R36 = 45: 100R 0805 0.125W 5%; Part Number: SMD0805-100R 5%; Azonosító: 45; Category: Passives; Subcategory: PASS_Resistor; Supplier 1: HESTORE; Supplier 1 order number: 100.449.24
R72 = 59: as R1 on sheet MainBoard_V100_PSU; Category: Passives; Subcategory: PASS_Resistor; Supplier 1: HESTORE; Supplier 1 order number: 100.403.38
U12 = 368: Battery Management Standalone 2 cell 2A Boost battery charger for USB input with Power Path 24-VQFN -40 to 85; Azonosító: 368; Part Number: BQ25886; Category: Semiconductors; Subcategory: IC_Power; Supplier 1: MOUSER; Supplier 1 order number: 595-BQ25886RGER; Supplier 2: DIGIKEY; Supplier 2 order number: 296-53573-1-ND
U13 = 367: Voltage Protection with Automatic Cell Balance for 2-Cell Li-Ion Batteries, OVP=4.3 V, -40 to 85 degC, 8-pin SON (DRB), Green (RoHS & no Sb/Br); Manufacturer: Texas Instruments; SubFamily: Lithium Ion Protection; Lead Acid: N; Azonosító: 367; PackageReference: DRB0008B; Li-Ion: N; PackageVersion: revK, Jun-2012; PartNumber: BQ29209DRBR; Eco-Plan: Green (RoHS & no Sb/Br); DatasheetVersion: SLUSA52A; PackageDescription: 8-Pin Plastic Small Outline No-Lead, 3 x 3 x 1 mm Body, 0.65 mm Pitch, Exposed Pad; Li-Polymer: N; Mounting Technology: Surface Mount; Over Voltage Protection: N; NiCd: N; ComponentLink1URL: http://www.ti.com/general/docs/lit/getliterature.tsp?genericPartNumber=BQ29209&fileType=pdf; ComponentLink1Description: Datasheet; NiMH: N; Part Number: BQ29209DRBR; Category: Semiconductors; Subcategory: IC_Power; Supplier 1: MOUSER; Supplier 1 order number: 595-BQ29209DRBR; Help URL: https://www.ti.com/lit/ds/symlink/bq29209.pdf?ts=1707500814876&ref_url=https%253A%252F%252Fwww.ti.com%252Fproduct%252Fde-de%252FBQ29209

## Sheet MainBoard_V100_PSU_5V.SchDoc
size A4; SheetNumber: 8; SheetTotal: 22; Title_: +5V Power Supply
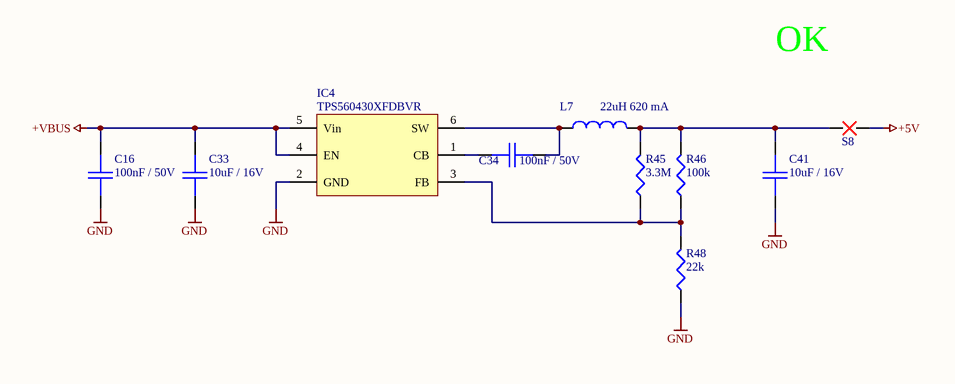
[diagram p7: MainBoard_V100_PSU_5V.SchDoc]

### Parts
C16  100nF / 50V  [0805_C]
C33  10uF / 16V  [0805_C]
C34  100nF / 50V  [0805_C]
C41  10uF / 16V  [0805_C]
IC4  TPS560430XFDBVR  [SOT-23-6]
L7  22uH 620 mA  [1210]
R45  3.3M  [0805]
R46  100k  [0805]
R48  22k  [0805]
S8  SPLITER  [SPLITER2_30mil_9mil]  (value not drawn)  (no BOM)

### Nets
+5V: S8.2
+VBUS: C16.1 C33.1 IC4.4(EN) IC4.5(Vin)
GND: C16.2 C33.2 C41.2 IC4.2(GND) R48.1
NetC34_1: C34.1 IC4.1(CB)
NetC34_2: C34.2 IC4.6(SW) L7.1
NetC41_1: C41.1 L7.2 R45.2 R46.2 S8.1
NetIC4_3: IC4.3(FB) R45.1 R46.1 R48.2

### Notes on the sheet
- OK
- Board:
- Author:
- Title:
- Project:
- SVN:
- Version:
- Sheet:
- of
- Contact:
- Modified:
- Size:
- A4

### Library data of the parts
C16 C34 = 149: as C94 on sheet MainBoard_V100_PSU; Category: Passives; Subcategory: PASS_Capacitor; Supplier 1: HESTORE; Supplier 1 order number: 100.011.22
C33 C41 = 153: as C50 on sheet MainBoard_V100_PSU_DIG; Category: Passives; Subcategory: PASS_Capacitor; Supplier 1: HESTORE; Supplier 1 order number: 100.344.52
IC4 = 192: as IC1 on sheet MainBoard_V100_PSU_DIG; Part Number: TPS560430XFDBVR; Category: Integrated Circuits; Subcategory: ICs__Power; Supplier 1: MOUSER; Supplier 1 order number: 595-TPS560430XFDBVR; Supplier 2: DIGIKEY; Supplier 2 order number: 296-52607-1-ND; Help URL: https://www.ti.com/general/docs/suppproductinfo.tsp?distId=26&gotoUrl=https://www.ti.com/lit/gpn/tps560430
L7 = 387: as L5 on sheet MainBoard_V100_PSU_DIG; Category: Passives; Subcategory: PASS_Inductor; Supplier 1: MOUSER; Supplier 1 order number: 963-CBC3225T220KR; Help URL: https://hu.mouser.com/datasheet/2/396/wound02_e-2256580.pdf
R45 = 72: 3.3M 0805 0.125W 5%; Part Number: SMD0805-3.3M 5%; Azonosító: 72; Category: Passives; Subcategory: PASS_Resistor; Supplier 1: HESTORE; Supplier 1 order number: 100.320.32
R46 = 66: as R38 on sheet MainBoard_V100_PSU_DET; Category: Passives; Subcategory: PASS_Resistor; Supplier 1: HESTORE; Supplier 1 order number: 100.011.43
R48 = 388: as R58 on sheet MainBoard_V100_PSU_DIG; Category: Passives; Subcategory: PASS_Resistor; Supplier 1: HESTORE; Supplier 1 order number: 100.011.64
S8 = 272: SPLITER2_30mil_9mil; Azonosító: 272; Part Number: SPLITER2_30mil_9mil; Category: Accessories; Subcategory: ACCE_Other

## Sheet MainBoard_V100_CON.SchDoc
size A4; SheetNumber: 9; SheetTotal: 22; Title_: Connector
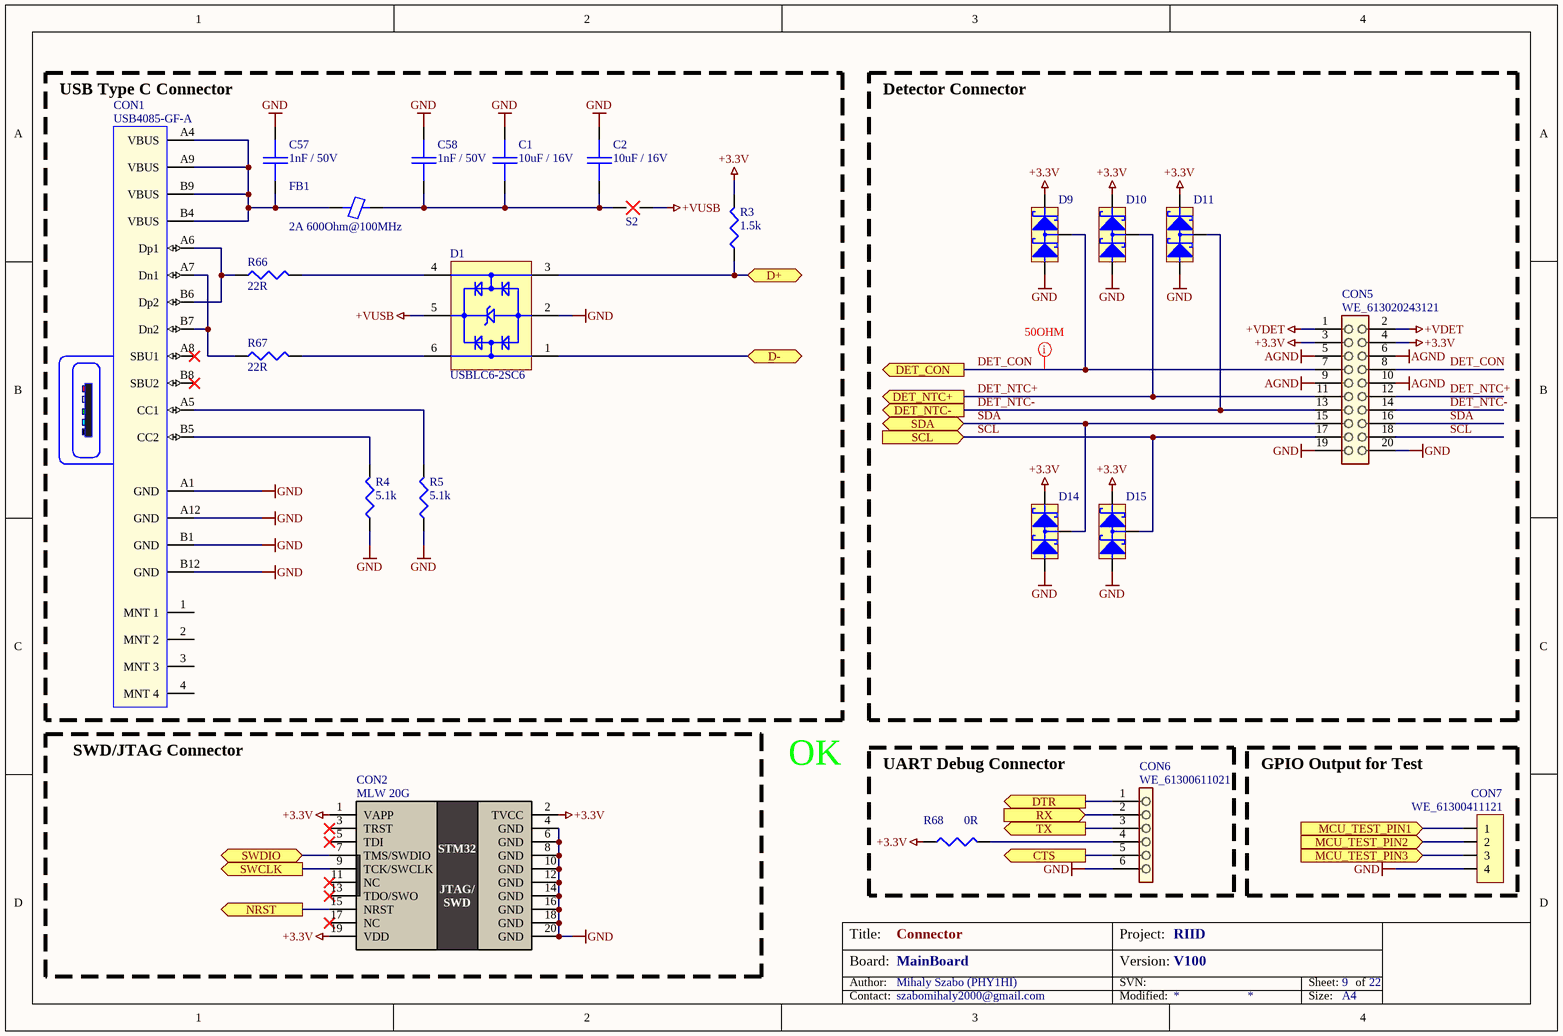
[diagram p8: MainBoard_V100_CON.SchDoc]

### Parts
C1  10uF / 16V  [0805_C]
C2  10uF / 16V  [0805_C]
C57  1nF / 50V  [0805_C]
C58  1nF / 50V  [0805_C]
CON1  USB4085-GF-A  [FP-USB4085-GF-A-MFG]
CON2  MLW 20G  [CON_MLW20G_TH]
CON5  WE_613020243121  [CON_HEADER20_2ROW_2.54_90DEG]
CON6  WE_61300611021  [WE_61300611021]
CON7  WE_61300411121  [CON4_SIMPLE_TH]
D1  USBLC6-2SC6  [SOT-23-6L]
D9  BAS70-04  [SOT-23]  (value not drawn)
D10  BAS70-04  [SOT-23]  (value not drawn)
D11  BAS70-04  [SOT-23]  (value not drawn)
D14  BAS70-04  [SOT-23]  (value not drawn)
D15  BAS70-04  [SOT-23]  (value not drawn)
FB1  2A 600Ohm@100MHz  [0805_FB]
R3  1.5k  [0805]
R4  5.1k  [0805]
R5  5.1k  [0805]
R66  22R  [0603]
R67  22R  [0603]
R68  0R  [0805]
S2  SPLITER  [SPLITER2_30mil_9mil]  (value not drawn)  (no BOM)

### Blocks framed on the sheet
USB Type C Connector: C1 C2 C57 C58 CON1 D1 FB1 R3-R5 R66 R67 S2
Detector Connector: CON5 D9-D11 D14 D15
SWD/JTAG Connector: CON2
UART Debug Connector: CON6 R68
GPIO Output for Test: CON7

### Ports
CTS (out), D+ (bidir), D- (bidir), DET_CON (out), DET_NTC+ (out), DET_NTC- (out), DTR (out), MCU_TEST_PIN1 (in), MCU_TEST_PIN2 (in), MCU_TEST_PIN3 (in), NRST (out), RX (in), SCL (in), SDA (bidir), SWCLK (out), SWDIO (bidir), TX (out)

### Nets
+3.3V: CON2.1(VAPP) CON2.2(TVCC) CON2.19(VDD) CON5.3 CON5.4 D9.2 D10.2 D11.2 D14.2 D15.2 R3.2 R68.1
+VDET: CON5.1 CON5.2
+VUSB: D1.5(VBUS) S2.2
AGND: CON5.5 CON5.6 CON5.9 CON5.10
GND: C1.1 C2.1 C57.2 C58.2 CON1.A1(GND) CON1.A12(GND) CON1.B1(GND) CON1.B12(GND) CON2.4(GND) CON2.6(GND) CON2.8(GND) CON2.10(GND) CON2.12(GND) CON2.14(GND) CON2.16(GND) CON2.18(GND) CON2.20(GND) CON5.19 CON5.20 CON6.6 CON7.4 D1.2(GND) D9.1 D10.1 D11.1 D14.1 D15.1 R4.1 R5.1
DET_CON: CON5.7 CON5.8 D9.3 ; port DET_CON
DET_NTC+: CON5.11 CON5.12 D10.3 ; port DET_NTC+
DET_NTC-: CON5.13 CON5.14 D11.3 ; port DET_NTC-
NRST: CON2.15(NRST) ; port NRST
SCL: CON5.17 CON5.18 D15.3 ; port SCL
SDA: CON5.15 CON5.16 D14.3 ; port SDA
SWDIO: CON2.7(TMS/SWDIO) ; port SWDIO
NetC1_2: C1.2 C2.2 C58.1 FB1.1 S2.1
NetC57_1: C57.1 CON1.A4(VBUS) CON1.A9(VBUS) CON1.B4(VBUS) CON1.B9(VBUS) FB1.2
NetCON1_A5: CON1.A5(CC1) R5.2
NetCON1_A6: CON1.A6(Dp1) CON1.B6(Dp2) R66.1
NetCON1_A7: CON1.A7(Dn1) CON1.B7(Dn2) R67.1
NetCON1_B5: CON1.B5(CC2) R4.2
NetCON2_9: CON2.9(TCK/SWCLK) ; port SWCLK
NetCON6_1: CON6.1 ; port DTR
NetCON6_2: CON6.2 ; port RX
NetCON6_3: CON6.3 ; port TX
NetCON6_4: CON6.4 R68.2
NetCON6_5: CON6.5 ; port CTS
NetCON7_1: CON7.1 ; port MCU_TEST_PIN1
NetCON7_2: CON7.2 ; port MCU_TEST_PIN2
NetCON7_3: CON7.3 ; port MCU_TEST_PIN3
NetD1_1: D1.1(I/O_1) ; port D-
NetD1_3: D1.3(I/O_2) R3.1 ; port D+
NetD1_4: D1.4(I/O_3) R66.2
NetD1_6: D1.6(I/O_4) R67.2

Not connected (* = marked no-connect by the designer): CON1 1(MNT_1) 2(MNT_2) 3(MNT_3) 4(MNT_4) A8(SBU1)* B8(SBU2)*; CON2 3(TRST)* 5(TDI)* 11(NC)* 13(TDO/SWO)* 17(NC)*

### Layout directives
net class 50R: DET_CON

### Notes on the sheet
- OK
- Board:
- Author:
- Title:
- Project:
- SVN:
- Version:
- Sheet:
- of
- Contact:
- Modified:
- Size:
- A4
- (in symbol 203) STM32; JTAG/; SWD

### Library data of the parts
C1 C2 = 153: as C50 on sheet MainBoard_V100_PSU_DIG; Category: Passives; Subcategory: PASS_Capacitor; Supplier 1: HESTORE; Supplier 1 order number: 100.344.52
C57 C58 = 144: as C90 on sheet MainBoard_V100_PSU_AFE; Category: Passives; Subcategory: PASS_Capacitor; Supplier 1: HESTORE; Supplier 1 order number: 100.200.70
CON1 = 308: USB Type C,USB 2.0, Rec,THT,  5A, 48V; USB Standard: USB 2.0; Azonosító: 308; Gender: Receptacle; Number of Positions: 16; Category: Connectors; Contact Material: Copper Alloy; Part Number: USB4085-GF-A; Subcategory: CONN_Board-to-Wire; Supplier 1: MOUSER; Supplier 1 order number: 640-USB4085-GF-A; Supplier 2: FARNELL; Supplier 2 order number: 2924867; Help URL: https://hu.mouser.com/datasheet/2/837/GCT_usb4085-3240028.pdf; Orientation: Right Angle; Contact Plating: Gold
CON2 = 203: JTAG/SWD Connector for ST-LINK/V2, 20pole; Part Number: JTAG/SWD ST-LINK/V2 20pole; Azonosító: 203; Category: Connectors; Subcategory: CONN_Board-to-Wire; Supplier 1: MOUSER; Supplier 1 order number: 710-61202021621; Supplier 2: RET; Supplier 2 order number: 53-12-88
CON5 = 395: Board-To-Board Connector, 90DEG, 2.54 mm, 2x10 Contacts, Header, WR-PHD Series, Through Hole; Azonosító: 395; Part Number: 613020243121; Category: Connectors; Subcategory: ELME_Other; Supplier 1: MOUSER; Supplier 1 order number: 710-613020243121; Help URL: https://www.we-online.com/components/products/datasheet/613020243121.pdf; System: Connector
CON6 = 397: Board-To-Board Connector, 90 DEG, 2.54 mm, 6 Contacts, Header, WR-PHD Series, Through Hole; Azonosító: 397; Part Number: 61300611021; Category: Connectors; Subcategory: ELME_Other; Supplier 1: MOUSER; Supplier 1 order number: 710-61300611021; Help URL: https://www.we-online.com/components/products/datasheet/61300611021.pdf
CON7 = 250: Board-To-Board Connector, Vertical, 2.54 mm, 4 Contacts, Header, WR-PHD Series, Through Hole; Part Number: Pin Header 04 Pole 1 Row 2.54mm; Azonosító: 250; Category: Connectors; Subcategory: CONN_Board-to-Board; Supplier 1: MOUSER; Supplier 1 order number: 710-61300411121; Supplier 2: FARNELL; Supplier 2 order number: 2356155
D1 = 341: Very low capacitance ESD protection, 3.5 pF, -40 to 125 degC, 6-Pin SOT23; Manufacturer: STMicroelectronics; Polarity: Uni-Directional; Clamping Voltage: 17V; Rad Hardened: No; Product Height (mm): 1.3mm; Leakage Current (Max): 0.15uA; Product Length (mm): 3.05mm; Number of Elements: 1; Peak Pulse Current: 5A; Configuration: Dual; Reverse Breakdown Voltage: 6V; Working Voltage (Max): 5V; Capacitance Value: 3.5pF; Suppressor Type: DiodeArrays; Product Depth (mm): 1.75mm; Test Current (It): 1mA; Azonosító: 341; Package / Case: SOT-23; Operating Temperature Max Deg. C: 125C; Package Description: 6-Pin Small Outline Transistor, Body 2.925 x 1.625 mm, Pitch 0.95 mm; Package Reference: SOT23-6L; Datasheet Version: Rev. 5, 10/2011; Operating Temperature Min Deg. C: -40C; Mounting Style: SurfaceMount; Direction Type: Uni-Directional; Mounting: SurfaceMount; Pin Count: 6; Leakage Current: 0.15uA; Packaging: TapeandReel; Operating Temperature Classification: Automotive; Clamping Voltage (Max): 17V; Manufacturer URL: http://www.st.com/; Reverse Stand-off Voltage: 5V; Datasheet URL: http://www.st.com/st-web-ui/static/active/en/resource/technical/document/datasheet/CD00050750.pdf; Working Voltage: 5V; Operating Temp Range: -40Cto125C; Part Number: USBLC6-2SC6; Category: Integrated Circuits; Subcategory: SEMI_TVS; Supplier 1: MOUSER; Supplier 1 order number: 511-USBLC6-2SC6; Supplier 2: FARNELL; Supplier 2 order number: 1269406; Help URL: https://hu.mouser.com/datasheet/2/389/usblc6_2-1852789.pdf
D9-D11 D14 D15 = 191: Small Signal Schottky Diode, Dual Series, 70 V, 15 mA, 1 V, 100 mA, 150 °C; Part Number: BAS70-04LT1G; Azonosító: 191; Category: Semiconductors; Subcategory: SEMI_Schottky Array; Supplier 1: MOUSER; Supplier 1 order number: 771-BAS70-04-QR; Supplier 2: FARNELL; Supplier 2 order number: 1431108; Help URL: https://hu.mouser.com/datasheet/2/916/BAS70_04_Q-2937484.pdf
FB1 = 183: as FB8 on sheet MainBoard_V100_PSU_DET; Category: Passives; Subcategory: PASS_Other; Supplier 1: HESTORE; Supplier 1 order number: 100.327.86
R3 = 379: 1.5k 0805 0.125W 1%; Part Number: SMD0805-1.5k-1%; Azonosító: 379; Category: Passives; Subcategory: PASS_Resistor; Supplier 1: HESTORE; Supplier 1 order number: 100.327.80
R4 R5 = 378: as R28 on sheet MainBoard_V100_CHARGER; Category: Passives; Subcategory: PASS_Resistor; Supplier 1: HESTORE; Supplier 1 order number: 100.013.49
R66 R67 = 10: 22R 0603 0.1W 5%; Part Number: SMD0603-22R-5%; Azonosító: 10; Category: Passives; Subcategory: PASS_Resistor; Supplier 1: HESTORE; Supplier 1 order number: 100.239.27; Help URL: https://www.hestore.hu/prod_getfile.php?id=306
R68 = 38: as R44 on sheet MainBoard_V100_PSU_DET; Category: Passives; Subcategory: PASS_Resistor; Supplier 1: HESTORE; Supplier 1 order number: 100.275.70
S2 = 272: SPLITER2_30mil_9mil; Azonosító: 272; Part Number: SPLITER2_30mil_9mil; Category: Accessories; Subcategory: ACCE_Other

## Sheet MainBoard_V100_AFE.SchDoc
size A4; SheetNumber: 10; SheetTotal: 22; Title_: Analog Front End
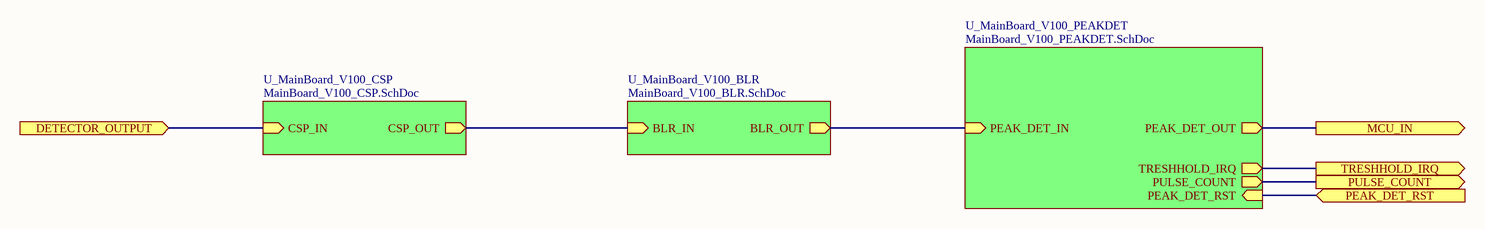
[diagram p9: MainBoard_V100_AFE.SchDoc]

### Sub-sheets
U_MainBoard_V100_BLR = MainBoard_V100_BLR.SchDoc: BLR_IN (in), BLR_OUT (out)
U_MainBoard_V100_CSP = MainBoard_V100_CSP.SchDoc: CSP_OUT (out), CSP_IN (in)
U_MainBoard_V100_PEAKDET = MainBoard_V100_PEAKDET.SchDoc: PEAK_DET_RST (in), PEAK_DET_OUT (out), TRESHHOLD_IRQ (out), PULSE_COUNT (out), PEAK_DET_IN (in)

### Ports
DETECTOR_OUTPUT (in), MCU_IN (out), PEAK_DET_RST (in), PULSE_COUNT (out), TRESHHOLD_IRQ (out)

### Nets
PEAK_DET_RST: port PEAK_DET_RST, sheet U_MainBoard_V100_PEAKDET/PEAK_DET_RST
PULSE_COUNT: port PULSE_COUNT, sheet U_MainBoard_V100_PEAKDET/PULSE_COUNT
TRESHHOLD_IRQ: port TRESHHOLD_IRQ, sheet U_MainBoard_V100_PEAKDET/TRESHHOLD_IRQ
(unnamed): port DETECTOR_OUTPUT, sheet U_MainBoard_V100_CSP/CSP_IN
(unnamed): port MCU_IN, sheet U_MainBoard_V100_PEAKDET/PEAK_DET_OUT
(unnamed): sheet U_MainBoard_V100_BLR/BLR_IN, sheet U_MainBoard_V100_CSP/CSP_OUT
(unnamed): sheet U_MainBoard_V100_BLR/BLR_OUT, sheet U_MainBoard_V100_PEAKDET/PEAK_DET_IN

### Notes on the sheet
- Board:
- Author:
- Title:
- Project:
- SVN:
- Version:
- Sheet:
- of
- Contact:
- Modified:
- Size:
- A4